# EAGLE schematic rc_servo (EAGLE 7.2.0)
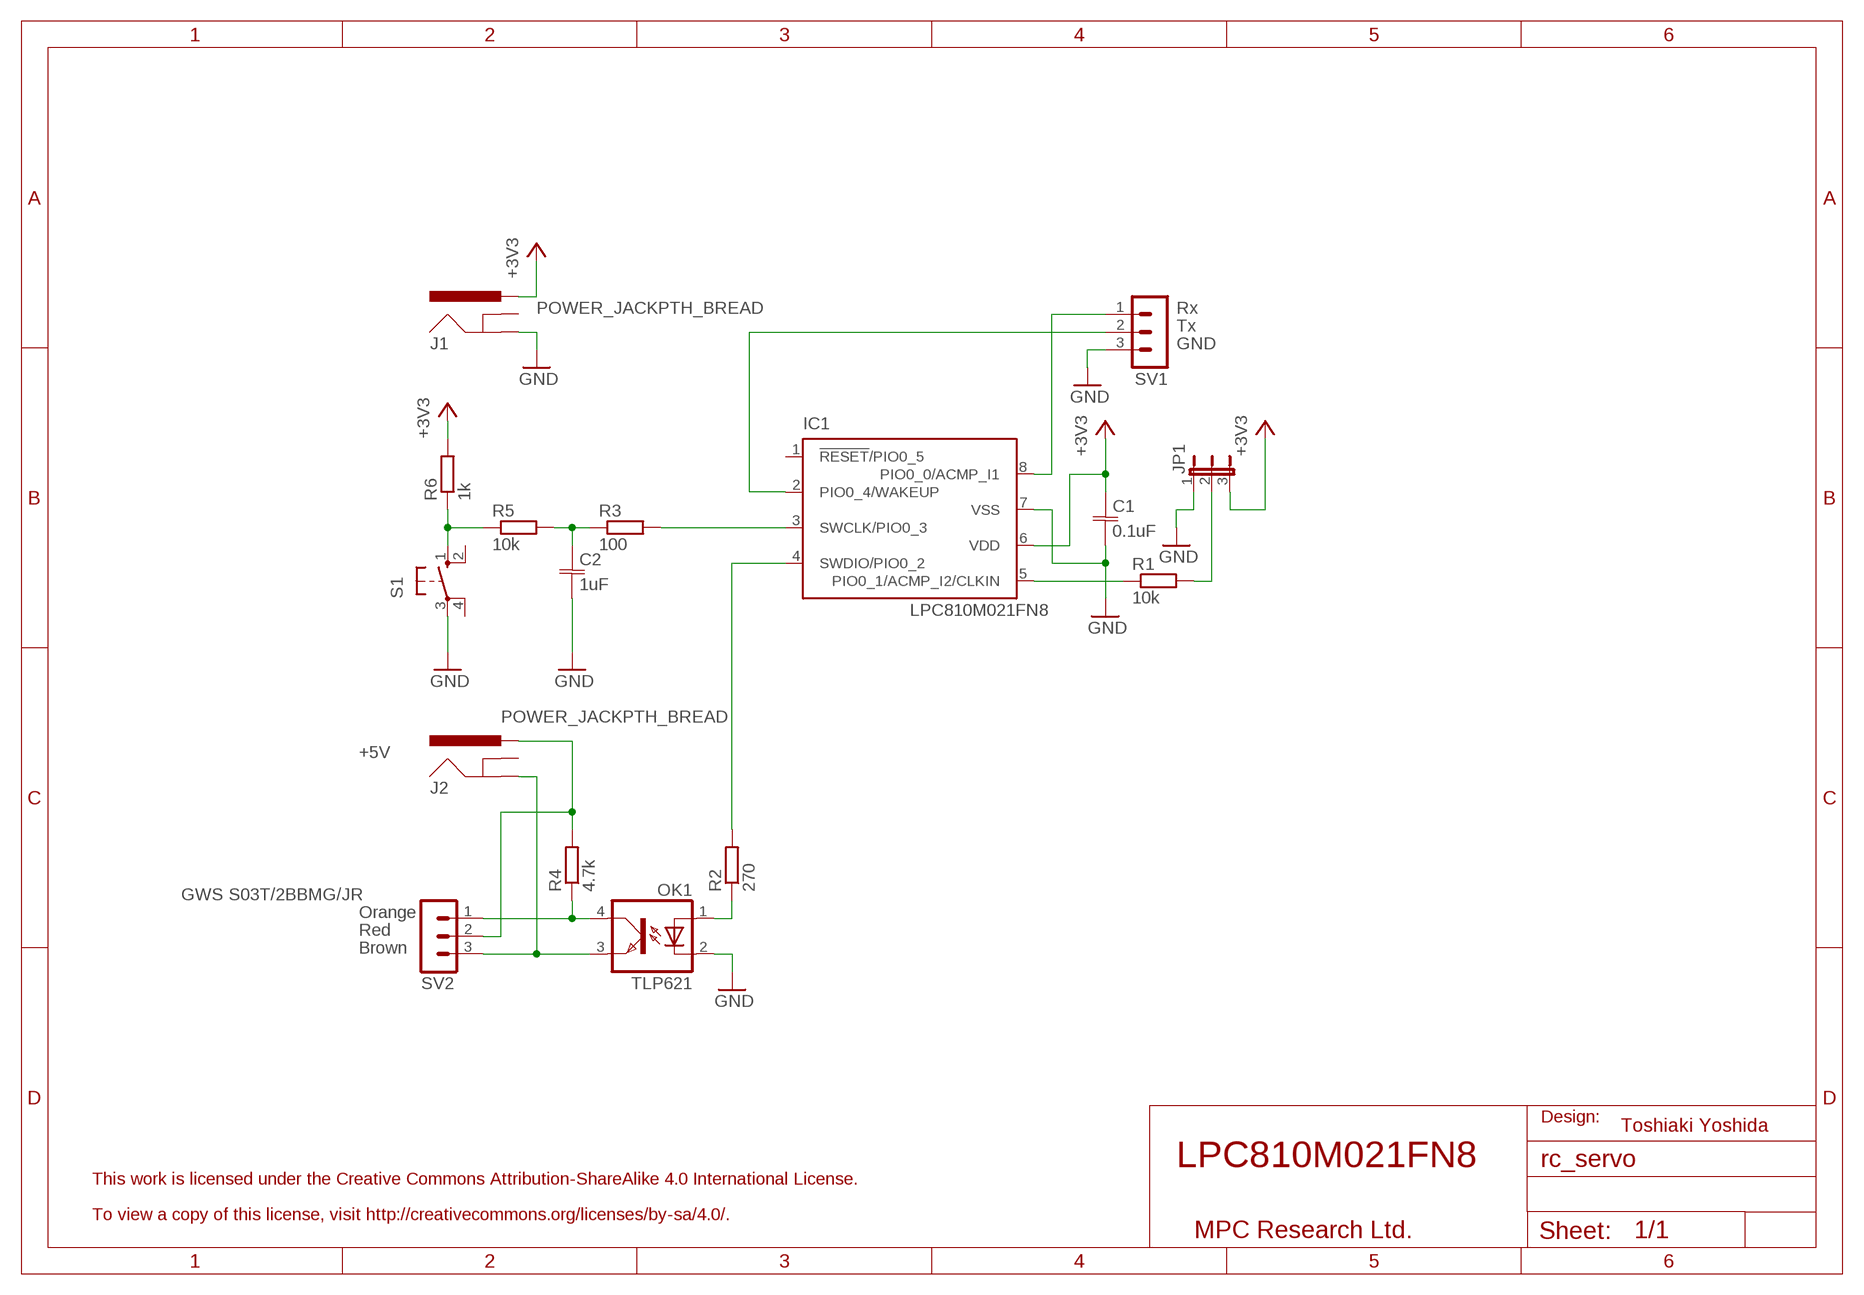
[diagram p0: schematic, sheet 1]

## Parts
C1  0.1uF  C-JIS050-024X044  [C050-024X044]
C2  1uF  C-JIS050-024X044  [C050-024X044]
IC1  LPC810M021FN8  [DIL08]
J1  POWER_JACKPTH_BREAD  [POWER_JACK_PTH_BREAD]
J2  POWER_JACKPTH_BREAD  [POWER_JACK_PTH_BREAD]
JP1  JP2E  [JP2]
OK1  TLP621  PC817  [DIL04]
R1  10k  R-EU_0207/10  [0207/10]
R2  270  R-EU_0207/10  [0207/10]
R3  100  R-EU_0207/10  [0207/10]
R4  4.7k  R-EU_0207/10  [0207/10]
R5  10k  R-EU_0207/10  [0207/10]
R6  1k  R-EU_0207/10  [0207/10]
S1  10-XX  [B3F-10XX]
SV1  MA03-1  [MA03-1]
SV2  MA03-1  [MA03-1]

## Nets
+3V3: C1.1 IC1.6(VDD) J1.PWR JP1.3 R6.2
GND: C1.2 C2.2 IC1.7(VSS) J1.GND JP1.1 OK1.2(C) S1.3(P) SV1.3
N$1: OK1.1(A) R2.1
N$2: IC1.4(SWDIO/PIO0_2) R2.2
N$3: IC1.5(PIO0_1/ACMP_I2/CLKIN) R1.1
N$4: JP1.2 R1.2
N$5: IC1.8(PIO0_0/ACMP_I1) SV1.1
N$6: IC1.2(PIO0_4/WAKEUP) SV1.2
N$7: R5.1 R6.1 S1.1(S)
N$8: C2.1 R3.1 R5.2
N$9: IC1.3(SWCLK/PIO0_3) R3.2
N$11: J2.PWR R4.2 SV2.2
N$12: OK1.4(COL) R4.1 SV2.1
N$13: J2.GND OK1.3(EMIT) SV2.3
Unconnected: IC1.1(!RESET!/PIO0_5) J1.GNDBREAK J2.GNDBREAK S1.2(S1) S1.4(P1)

## Notes on the sheet
- Rx
- Tx
- GND
- +5V
- GWS S03T/2BBMG/JR
- Orange
- Red
- Brown
- Design:
- Toshiaki Yoshida
- LPC810M021FN8
- This work is licensed under the Creative Commons Attribution-ShareAlike 4.0 International License.
- To view a copy of this license, visit http://creativecommons.org/licenses/by-sa/4.0/.
- MPC Research Ltd.

## Library data of the parts
C1 C2 = cap:C-JIS: CAPACITOR, Japanese symbol
IC1 = nxp:LPC810M021
J1 J2 = SparkFun-Connectors:POWER_JACK: Power Jack This is the standard 5.5mm barrel jack for power. The PTH is the most common, proven, reliable, footprint. The Slot footprint only works if the mill layer is transmitted to the PCB fab house so be warned. Mating wall wart : TOL-00298 (and others); PROD_ID: PRT-10811
JP1 = jumper:JP2E: JUMPER
OK1 = optocoupler:PC817: SHARP OPTO COUPLER; MPN: PC817X4J000F; OC_FARNELL: 9707727; OC_NEWARK: 97K7059
R1-R6 = resistor:R-EU_: RESISTOR, European symbol
S1 = switch-omron:10-XX: OMRON SWITCH; MPN: B3F-1000; OC_FARNELL: 176432; OC_NEWARK: 36M3542
SV1 SV2 = con-lstb:MA03-1: PIN HEADER; OC_FARNELL: unknown; OC_NEWARK: unknown